# Altium project PBL4_Project.PrjPcb
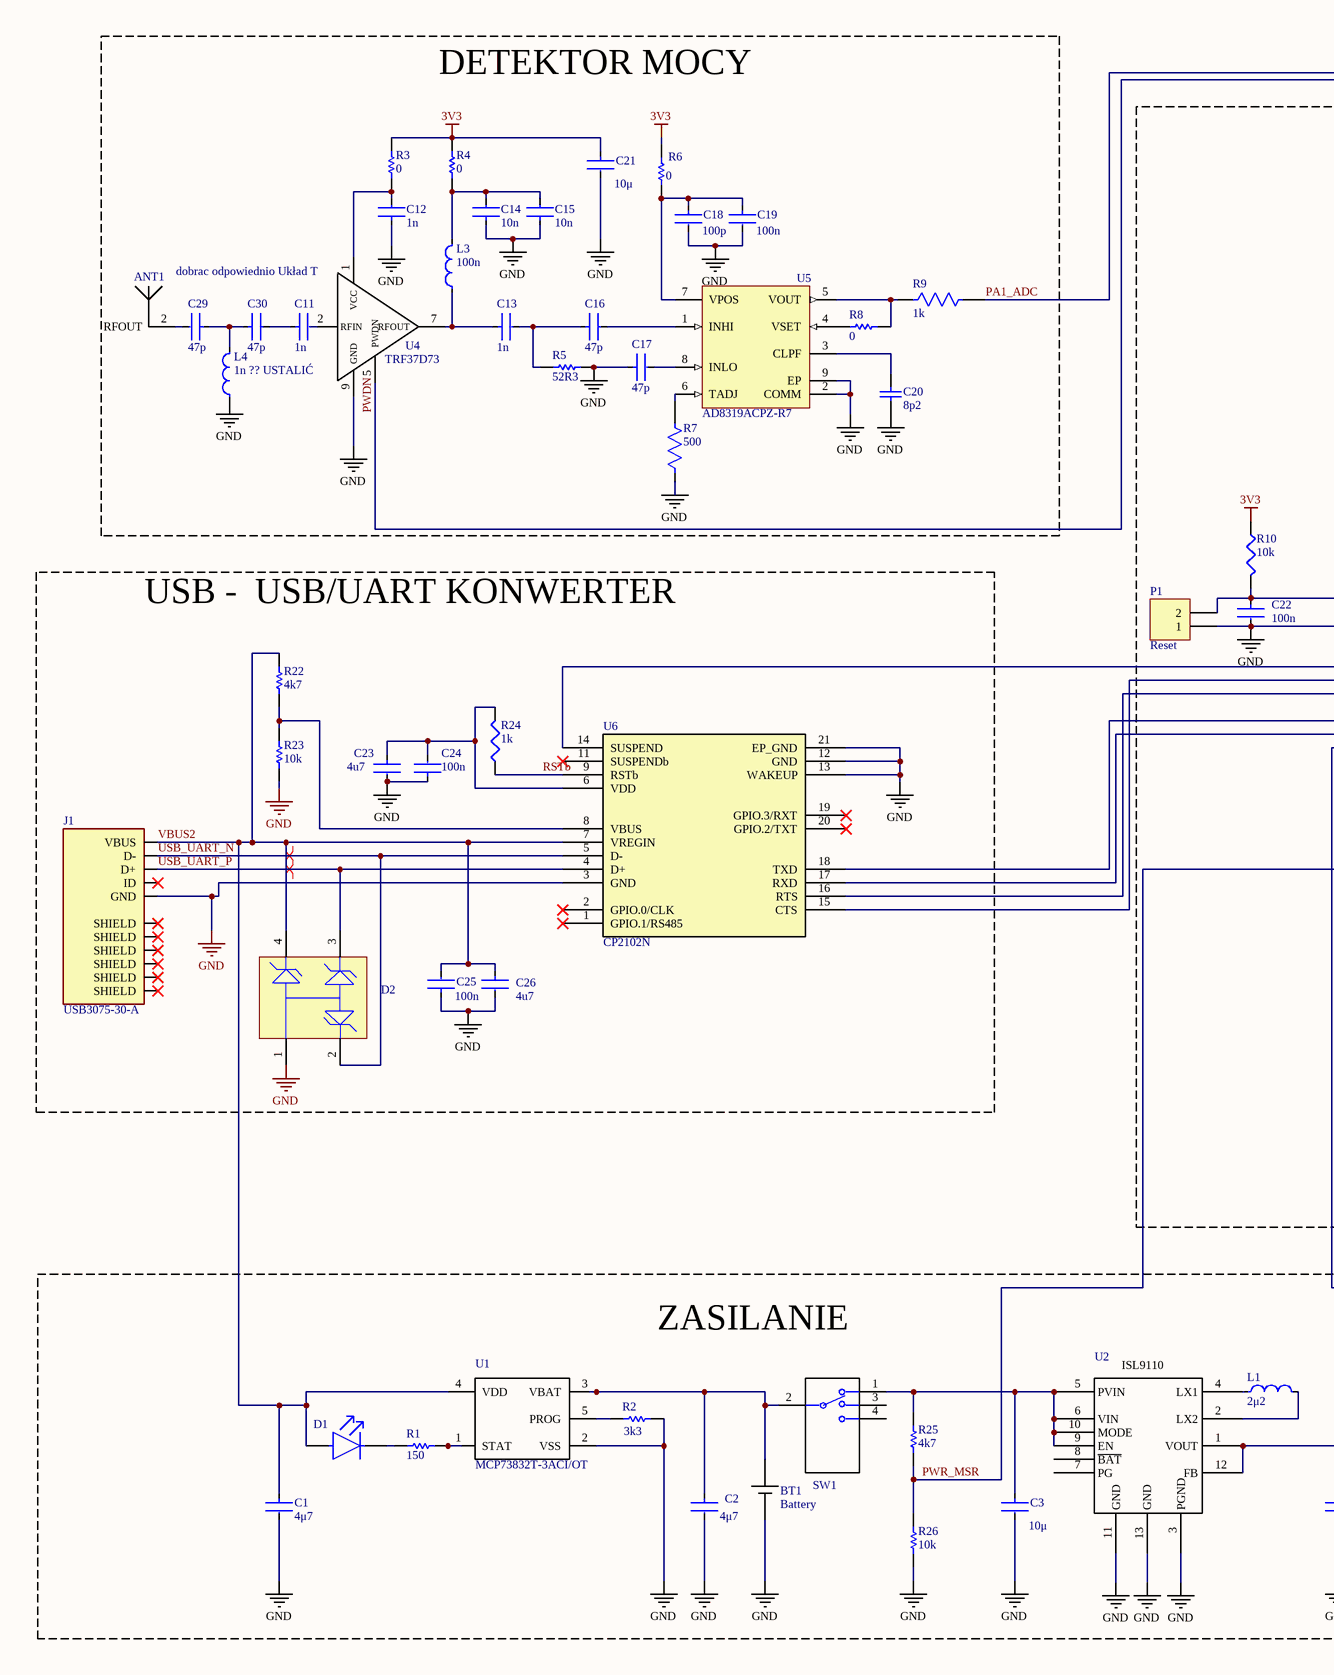
[diagram p0: PBL44_Sch.SchDoc, left]
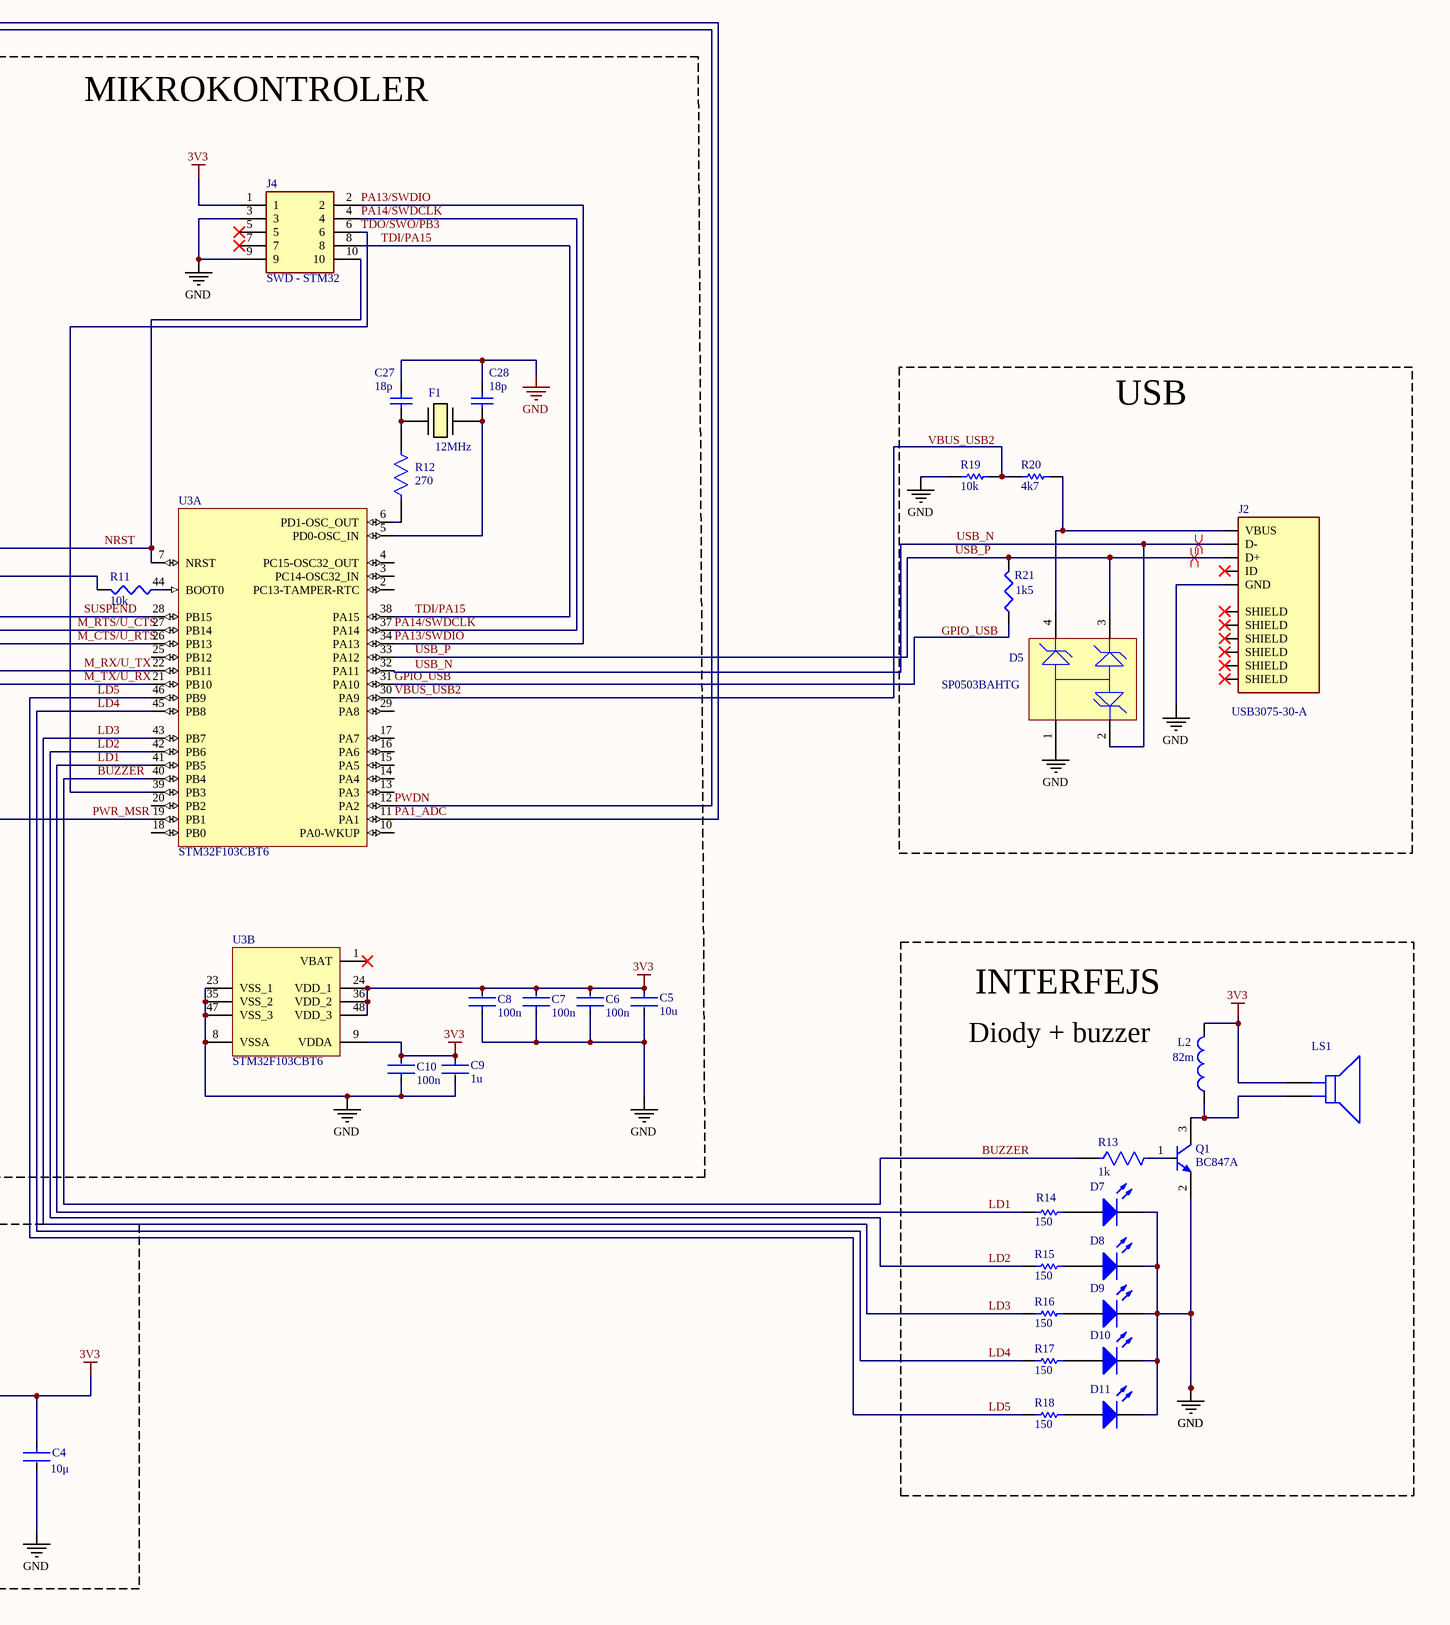
[diagram p1: PBL44_Sch.SchDoc, right]
1 sheet, 84 parts. Net scope: global (net labels, ports and power ports of the same name join across sheets).
Board file: PBL4_PCB.PcbDoc

## Sheet PBL44_Sch.SchDoc
size A2; SheetNumber: 1; SheetTotal: 1; SPICEModelCacheMSKFRAYQ: <root> / <DocumentId>MSKFRAYQ</DocumentId> / <CacheFrame Number="0"> / <Model Name="led1" Kind="MDL"> / <Text>*Typ RED GaAs LED: Vf=1.7V Vr=4V If=40mA trr=3uS / *LED Pinout: 1=A, 2=K / .MODEL LED1 D (IS=93.2P RS=42M N=3.73 BV=4 IBV=10U / + CJO=2.97P VJ=.75 M=.333 TT=4.32U)</Text> / </Model> / </CacheFrame> / </root>

### Parts
ANT1  2195852-1  [Antena]  (value not drawn)
BT1  Battery  [HDR1X2]
C1  Capacitance: 4μ7  [FP-C2012-125-0_2-IPC_B]
C2  Capacitance: 4μ7  [FP-C2012-125-0_2-IPC_B]
C3  value 10μ  [FP-C0805C-DG-MFG]
C4  value 10μ  [FP-C0805C-DG-MFG]
C5  value 10u  [FP-C0805C-DN-MFG]  (hidden comment: C0805C470J1GACTU)
C6  Capacitance: 100n  [FP-C0603C-CF-MFG]  (hidden comment: C0603C103K1RACTU)
C7  Capacitance: 100n  [FP-C0603C-CF-MFG]  (hidden comment: C0603C103K1RACTU)
C8  Capacitance: 100n  [FP-C0603C-CF-MFG]  (hidden comment: C0603C103K1RACTU)
C9  value 1u  [FP-C0805C-DN-MFG]  (hidden comment: C0805C470J1GACTU)
C10  Capacitance: 100n  [FP-C0603C-CF-MFG]  (hidden comment: C0603C103K1RACTU)
C11  Capacitance: 1n  [FP-0603-L_1_6_0_15-W_0_81-IPC_A]  (hidden comment: 06035C102KAT2A)
C12  Capacitance: 1n  [FP-0603-L_1_6_0_15-W_0_81-IPC_A]  (hidden comment: 06035C102KAT2A)
C13  Capacitance: 1n  [FP-0603-L_1_6_0_15-W_0_81-IPC_A]  (hidden comment: 06035C102KAT2A)
C14  Capacitance: 10n  [FP-C0603C-CF-MFG]  (hidden comment: C0603C103K1RACTU)
C15  Capacitance: 10n  [FP-C0603C-CF-MFG]  (hidden comment: C0603C103K1RACTU)
C16  value 47p  [FP-C0805C-DN-MFG]  (hidden comment: C0805C470J1GACTU)
C17  value 47p  [FP-C0805C-DN-MFG]  (hidden comment: C0805C470J1GACTU)
C18  Capacitance: 100p  [FP-C0603C-CF-MFG]  (hidden comment: C0603C104K5RACTU)
C19  Capacitance: 100n  [FP-C0603C-CF-MFG]  (hidden comment: C0603C104K5RACTU)
C20  Capacitance: 8p2  [CAPC1608X73X35ML10T15]  (hidden comment: 06035J8R2BBSTR)
C21  value 10μ  [FP-C0805C-DG-MFG]
C22  Capacitance: 100n  [FP-C2012-125-0_2-IPC_B]
C23  value 4u7  [FP-C0805C-DN-MFG]  (hidden comment: C0805C470J1GACTU)
C24  Capacitance: 100n  [FP-C0603C-CF-MFG]  (hidden comment: C0603C103K1RACTU)
C25  Capacitance: 100n  [FP-C0603C-CF-MFG]  (hidden comment: C0603C103K1RACTU)
C26  value 4u7  [FP-C0805C-DN-MFG]  (hidden comment: C0805C470J1GACTU)
C27  Capacitance: 18p  [CAPC1608X73X35ML10T15]  (hidden comment: 06035J8R2BBSTR)
C28  Capacitance: 18p  [CAPC1608X73X35ML10T15]  (hidden comment: 06035J8R2BBSTR)
C29  Capacitance: 47p  [FP-C0603C-CF-MFG]  (hidden comment: C0603C104K5RACTU)
C30  Capacitance: 47p  [FP-C0603C-CF-MFG]  (hidden comment: C0603C104K5RACTU)
D1  LTST-C190GKT  [FP-LTST-C190GKT-MFG]  (value not drawn)
D2  SP0503BAHTG  [LFUS-SOT143-4_V]  (value not drawn)
D5  SP0503BAHTG  [LFUS-SOT143-4_V]
D7  151051RS11000  [Type 5mm]  (value not drawn)
D8  151051RS11000  [Type 5mm]  (value not drawn)
D9  151051RS11000  [Type 5mm]  (value not drawn)
D10  151051RS11000  [Type 5mm]  (value not drawn)
D11  151051RS11000  [Type 5mm]  (value not drawn)
F1  12MHz  [HC/49US-(AT49)_1]
J1  USB3075-30-A  [GCT_USB3075-30-A]
J2  USB3075-30-A  [GCT_USB3075-30-A]
J4  SWD - STM32  [322110030000]
L1  Inductance: 2μ2  [FP-NR5040-H_4_1-MFG]  (hidden comment: NRS5040T2R2NMGJ)
L2  Inductance: 82m  [WE-TIS 1111]  (hidden comment: 7447471104)
L3  Inductance: 100n  [FP-LQW18AN_00-MFG]  (hidden comment: LQW18ANR10G00D)
L4  Inductance: 1n ?? USTALIĆ  [FP-LQW18AN_00-MFG]  (hidden comment: LQW18ANR10G00D)
LS1  7BB-20-6L0  [FP-7BB-20-6L0-MFG]  (value not drawn)
P1  Reset  [HDR1X2]
Q1  BC847A  [INF-SOT23_M]
R1  resistance: 150  [RESC1608X55X30ML15T15]  (hidden comment: ERJ-3EKF4700V)
R2  Resistance: 3k3  [RESC2013X60X35ML10T20]  (hidden comment: RC0805FR-073K3L)
R3  value 0  [RESC1609X50X30NL8T20]  (hidden comment: CRCW06030000Z0EA)
R4  value 0  [RESC1609X50X30NL8T20]  (hidden comment: CRCW06030000Z0EA)
R5  Resistance: 52R3  [RESC1608X55X30ML15T15]  (hidden comment: ERJ-3EKF52R3V)
R6  Resistance: 0  [RESC1609X50X30NL8T20]  (hidden comment: CRCW06030000Z0EA)
R7  Resistance: 500  [FP-MCT0603-MFG]  (hidden comment: MCT06030D5000BP100)
R8  Resistance: 0  [RESC1609X50X30NL8T20]  (hidden comment: CRCW06030000Z0EA)
R9  Resistance: 1k  [FP-CRCW0603-e3-MFG]  (hidden comment: CRCW06031K00FKEA)
R10  value 10k  [J1-0603]  (hidden comment: Res3)
R11  value 10k  [J1-0603]  (hidden comment: Res3)
R12  Resistance: 270  [FP-CRCW0603-e3-MFG]  (hidden comment: CRCW06031K00FKEA)
R13  Resistance: 1k  [FP-CRCW0603-e3-MFG]  (hidden comment: CRCW06031K00FKEA)
R14  resistance: 150  [RESC1608X55X30ML15T15]  (hidden comment: ERJ-3EKF4700V)
R15  resistance: 150  [RESC1608X55X30ML15T15]  (hidden comment: ERJ-3EKF4700V)
R16  resistance: 150  [RESC1608X55X30ML15T15]  (hidden comment: ERJ-3EKF4700V)
R17  resistance: 150  [RESC1608X55X30ML15T15]  (hidden comment: ERJ-3EKF4700V)
R18  resistance: 150  [RESC1608X55X30ML15T15]  (hidden comment: ERJ-3EKF4700V)
R19  Resistance: 10k  [RESC2013X60X35ML10T20]  (hidden comment: RC0805FR-073K3L)
R20  Resistance: 4k7  [RESC2013X60X35ML10T20]  (hidden comment: RC0805FR-073K3L)
R21  value 1k5  [J1-0603]  (hidden comment: Res3)
R22  Resistance: 4k7  [RESC2013X60X35ML10T20]  (hidden comment: RC0805FR-073K3L)
R23  Resistance: 10k  [RESC2013X60X35ML10T20]  (hidden comment: RC0805FR-073K3L)
R24  value 1k  [J1-0603]  (hidden comment: Res3)
R25  Resistance: 4k7  [RESC2013X60X35ML10T20]  (hidden comment: RC0805FR-073K3L)
R26  Resistance: 10k  [RESC2013X60X35ML10T20]  (hidden comment: RC0805FR-073K3L)
SW1  MHS133G04  [Alcoswitch_MHS133G04_0]  (value not drawn)
U1  MCP73832T-3ACI/OT  [SOT-23-OT5_M]
U2  ISL9110  [KM_L12.3x3C]  (value not drawn)
U3  STM32F103CBT6  [STM-LQFP48_L]  (parts A,B of 2)
U4  TRF37D73  [JD_WSON-8]
U5  AD8319ACPZ-R7  [ADI-CP-8-1_L]
U6  CP2102N  [ZW_QFN20]

### Blocks framed on the sheet
DETEKTOR MOCY: ANT1 C11-C21 C29 C30 L3 L4 R3-R9 U4 U5
MIKROKONTROLER: C5-C10 C22 C27 C28 F1 J4 P1 R10-R12 U3
USB: D5 J2 R19-R21
USB -  USB/UART KONWERTER: C23-C26 D2 J1 R22-R24 U6
INTERFEJS: D7-D11 L2 LS1 Q1 R13-R18
ZASILANIE: BT1 C1-C4 D1 L1 R1 R2 R25 R26 SW1 U1 U2

### Nets
3V3: C4.1 C5.1 C6.2 C7.2 C8.2 C9.1 C10.2 C21.1 J4.1 L2.2 LS1.17 R3.2 R4.2 R6.2 R10.1 U2.1(VOUT) U2.12(FB) U3.9(VDDA) U3.24(VDD_1) U3.36(VDD_2) U3.48(VDD_3)
GND: BT1.1 C1.2 C2.2 C3.2 C4.2 C5.2 C6.1 C7.1 C8.1 C9.2 C10.1 C12.1 C14.1 C15.1 C17.1 C18.2 C19.2 C20.1 C21.2 C22.2 C23.2 C24.1 C25.1 C26.2 C27.1 C28.2 D2.1 D5.1 D7.1(K) D8.1(K) D9.1(K) D10.1(K) D11.1(K) J1.5(GND) J2.5(GND) J4.3 J4.9 L4.1 P1.1 Q1.2(E) R2.2 R5.2 R7.1 R11.2 R19.2 R23.1 R26.2 U1.2(VSS) U2.3(PGND) U2.11(GND) U2.13(GND) U3.8(VSSA) U3.23(VSS_1) U3.35(VSS_2) U3.47(VSS_3) U4.9(GND) U5.2(COMM) U5.9(EP) U6.3(GND) U6.12(GND) U6.13(WAKEUP) U6.21(EP_GND)
BUZZER: R13.1 U3.40(PB4)
GPIO_USB: R21.1 U3.31(PA10)
LD1: R14.1 U3.41(PB5)
LD2: R15.1 U3.42(PB6)
LD3: R16.1 U3.43(PB7)
LD4: R17.1 U3.45(PB8)
LD5: R18.1 U3.46(PB9)
M_CTS/U_RTS: U3.26(PB13) U6.16(RTS)
M_RTS/U_CTS: U3.27(PB14) U6.15(CTS)
M_RX/U_TX: U3.22(PB11) U6.18(TXD)
M_TX/U_RX: U3.21(PB10) U6.17(RXD)
NRST: C22.1 J4.10 P1.2 R10.2 U3.7(NRST)
PA1_ADC: R9.2 U3.11(PA1)
PA13/SWDIO: J4.2 U3.34(PA13)
PA14/SWDCLK: J4.4 U3.37(PA14)
PWDN: U3.12(PA2) U4.5(PWDN)
PWR_MSR: R25.2 R26.1 U3.19(PB1)
RSTb: R24.2 U6.9(RSTb)
SUSPEND: U3.28(PB15) U6.14(SUSPEND)
TDI/PA15: J4.8 U3.38(PA15)
TDO/SWO/PB3: J4.6 U3.39(PB3)
USB_N: D5.2 J2.2(D-) U3.32(PA11)
USB_P: D5.3 J2.3(D+) R21.2 U3.33(PA12)
USB_UART_N: D2.2 J1.2(D-) U6.5(D-)
USB_UART_P: D2.3 J1.3(D+) U6.4(D+)
VBUS2: C1.1 C25.2 C26.1 D1.2(A) D2.4 J1.1(VBUS) R22.2 U1.4(VDD) U6.7(VREGIN)
VBUS_USB2: R19.1 R20.2 U3.30(PA9)
NetANT1_2: ANT1.2(RFOUT) C29.2
NetBT1_2: BT1.2 C2.1 SW1.2 U1.3(VBAT)
NetC3_1: C3.1 R25.1 SW1.1 U2.5(PVIN) U2.6(VIN) U2.9(EN) U2.10(MODE)
NetC11_1: C11.1 C30.2
NetC11_2: C11.2 U4.2(RFIN)
NetC12_2: C12.2 R3.1 U4.1(VCC)
NetC13_1: C13.1 L3.1 U4.7(RFOUT)
NetC13_2: C13.2 C16.1 R5.1
NetC14_2: C14.2 C15.2 L3.2 R4.1
NetC16_2: C16.2 U5.1(INHI)
NetC17_2: C17.2 U5.8(INLO)
NetC18_1: C18.1 C19.1 R6.1 U5.7(VPOS)
NetC20_2: C20.2 U5.3(CLPF)
NetC23_1: C23.1 C24.2 R24.1 U6.6(VDD)
NetC27_2: C27.2 F1.2 R12.2
NetC28_1: C28.1 F1.1 U3.5(PD0-OSC_IN)
NetC29_1: C29.1 C30.1 L4.2
NetD1_1: D1.1(C) R1.1
NetD5_4: D5.4 J2.1(VBUS) R20.1
NetD7_2: D7.2(A) R14.2
NetD8_2: D8.2(A) R15.2
NetD9_2: D9.2(A) R16.2
NetD10_2: D10.2(A) R17.2
NetD11_2: D11.2(A) R18.2
NetL1_1: L1.1 U2.4(LX1)
NetL1_2: L1.2 U2.2(LX2)
NetL2_1: L2.1 LS1.16 Q1.3(C)
NetQ1_1: Q1.1(B) R13.2
NetR1_2: R1.2 U1.1(STAT)
NetR2_1: R2.1 U1.5(PROG)
NetR7_2: R7.2 U5.6(TADJ)
NetR8_1: R8.1 U5.4(VSET)
NetR8_2: R8.2 R9.1 U5.5(VOUT)
NetR11_1: R11.1 U3.44(BOOT0)
NetR12_1: R12.1 U3.6(PD1-OSC_OUT)
NetR22_1: R22.1 R23.2 U6.8(VBUS)

Not connected (* = marked no-connect by the designer): ANT1 1(GND) 3(GND) 4(MNT); J1 4(ID)* S1(SHIELD)* S2(SHIELD)* S3(SHIELD)* S4(SHIELD)* S5(SHIELD)* S6(SHIELD)*; J2 4(ID)* S1(SHIELD)* S2(SHIELD)* S3(SHIELD)* S4(SHIELD)* S5(SHIELD)* S6(SHIELD)*; J4 5* 7*; SW1 3 4 5(MNT_1) 6(MNT_2); U2 7(PG) 8(~{BAT}); U3 1(VBAT)* 2(PC13-TAMPER-RTC) 3(PC14-OSC32_IN) 4(PC15-OSC32_OUT) 10(PA0-WKUP) 13(PA3) 14(PA4) 15(PA5) 16(PA6) 17(PA7) 18(PB0) 20(PB2) 25(PB12) 29(PA8); U6 1(GPIO.1/RS485)* 2(GPIO.0/CLK)* 11(SUSPENDb)* 19(GPIO.3/RXT)* 20(GPIO.2/TXT)*

### Layout directives
differential pair: USB_N, USB_P, USB_UART_N, USB_UART_P

### Notes on the sheet
- (near U4) dobrac odpowiednio Układ T
- (near L2) Diody + buzzer
- Labels drawn without touching a wire or pin: GPIO_USB, VBUS_USB2

### Library data of the parts
BT1 = KM_Battery_One_Cell
C1 C2 C22 = CMP-08246-000007-2: Multilayer Ceramic Capacitors 4.7μF ±10% 50V X5R SMD 0805; Case Code (Metric): 2012; Weight: 0.000194oz; Voltage Rating: 50V; Voltage: 50V; Construction: Flat; Series: C; Packaging: Tape and Reel; Height: 1.25mm; Depth: 1.25mm; Resistor Type: Ceramic; Width: 0.049inch; Length: 2mm; Thickness: 0.057inch; REACH SVHC: No SVHC; Max Operating Temperature: 85°C; Case/Package: 0805; Dielectric: X5R; Tolerance: 10%; Dielectric Material: Ceramic; Package Quantity: 1; Mount: Surface Mount; Radiation Hardening: No; Voltage Rating (DC): 50V; Case Code (Imperial): 0805; Termination: SMD/SMT; Min Operating Temperature: -55°C; Lead Free: Lead Free
C3 C4 C21 = CMP-2007-03243-2: CAP CER 10UF 10V X5R 0805; Manufacturer Part Number: C0805C106K8PACTU; Manufacturer: Kemet; 3DS Part Number: 220-00001; Tolerance: 10%; Temperature Coefficient: 15%; Material: Ceramic; Device Class L2: Capacitors; Device Class L1: Passive Components; ComponentLink2URL: https://content.kemet.com/datasheets/KEM_C1006_X5R_SMD.pdf; Height: 1.4mm; Lead Free: Yes; Digikey Description: CAP CER 10UF 10V X5R 0805; Octopart: https://octopart.com/c0805c106k8pactu-kemet-98697; Capacitance: 10uF; Temperature Range Low: -55°C; Temperature: -55°C to +85°C; Automotive: No; Mouser Description: CAP CER 10UF 10V X5R 0805; Ipc Land Pattern Name: CAPC200125X125; Temperature Range High: +85°C; Voltage: 10V; RoHS: TRUE; Device Class L3: Ceramic Capacitors; ComponentLink2Description: Datasheet; Voltage Rating: 10V; Package: C0805C-DG; Temperature Characteristic: X5R; Category: Cap
C5 C9 C16 C17 C23 C26 = CMP-1036-01631-3: CAP CER 47PF 100V 5% NP0 0805; Manufacturer: KEMET; Temperature Characteristic: C0G; Material: Ceramic; Temperature Coefficient: 30ppm/°C; Tolerance: 0.05; Device Class L3: Ceramic Capacitors; Package: C0805C-DN; Category: Cap; ComponentLink2URL: https://content.kemet.com/datasheets/KEM_C1003_C0G_SMD.pdf; Ipc Land Pattern Name: CAPC200125X78; Temperature Range Low: -55°C; Temperature: -55°C to +125°C; Temperature Range High: +125°C; Device Class L2: Capacitors; Height: 0.88mm; Octopart: https://octopart.com/c0805c470j1gactu-kemet-9138638; Digikey Description: CAP CER 47PF 100V 5% NP0 0805; Lead Free: Yes; Voltage Rating: 100 V; Device Class L1: Passive Components; Capacitance: 47 pF; Mouser Description: Capacitor: ceramic; MLCC; 47pF; 100V; C0G; ±5%; SMD; 0805; Manufacturer Part Number: C0805C470J1GACTU; RoHS: TRUE; ComponentLink2Description: Datasheet; Automotive: No
C6-C8 C10 C14 C15 C24 C25 = CMP-2006-03036-2: CAP CER 10000PF 100V X7R 0603; Manufacturer: KEMET; Temperature Coefficient: 30ppm/°C; Automotive Grade: Grade 1; Value: 10,000 pF; Tolerance: 0.1; Material: Ceramic; ComponentLink2URL: https://api.kemet.com/component-edge/download/datasheet/C0603C100J5GACAUTO.pdf; Height: 0.87mm; ComponentLink2Description: Datasheet; Category: Cap; Mouser Description: Multilayer Ceramic Capacitors MLCC - SMD/SMT 100volts 10000pF X7R 10%; Device Class L3: Ceramic Capacitors; Voltage Rating: 100 V; Temperature Range High: +125°C; Octopart: https://octopart.com/c0603c103k1ractu-kemet-134140; Package: C0603C-CF; Temperature Range Low: -55°C; Device Class L1: Passive Components; Temperature: -55°C to +125°C; RoHS: TRUE; Device Class L2: Capacitors; Lead Free: Yes; Temperature Characteristic: X7R; Manufacturer Part Number: C0603C103K1RACTU; Digikey Description: CAP CER 10000PF 100V X7R 0603; Automotive: Yes
C11-C13 = CMP-2006-04378-2: General Purpose Ceramic Capacitor, 0603, 1nF, 10%, X7R, 15%, 50V; Case Code (Metric): 1608; Min Operating Temperature: -55°C; Weight: 7.1E-05oz; Series: -; RoHS Compliant: Yes; Radiation Hardening: No; Height: 0.9mm; Mount: Surface Mount; REACH SVHC: No SVHC; Lead Free: Lead Free; Depth: 0.81mm; Voltage: 50V; Number of Pins: 2; Voltage Rating: 50V; Max Operating Temperature: 125°C; Termination: SMD/SMT; Construction: Flat; Case Code (Imperial): 0603; Dielectric: X7R; Width: 0.032inch; Tolerance: 10%; Case/Package: 0603; Contact Plating: Tin; Packaging: Tape and Reel; Voltage Rating (DC): 50V; Dielectric Material: Ceramic; Package Quantity: 4000; Thickness: 0.035inch; Length: 1.6mm
C18 C19 C29 C30 = CMP-2006-03061-2: CAP CER 0.1UF 50V X7R 0603; Manufacturer: KEMET; Tolerance: 0.1; Temperature Coefficient: 30ppm/°C; Material: Ceramic; Automotive Grade: Grade 1; Value: 0.10 μF; Temperature: -55°C to +125°C; RoHS: TRUE; Temperature Range High: +125°C; Lead Free: Yes; Octopart: https://octopart.com/c0603c104k5ractu-kemet-139244; Digikey Description: CAP CER 0.1UF 50V X7R 0603; Category: Cap; Package: C0603C-CF; ComponentLink2Description: Datasheet; Temperature Range Low: -55°C; Device Class L1: Passive Components; Voltage Rating: 50 V; Automotive: Yes; Device Class L3: Ceramic Capacitors; ComponentLink2URL: https://api.kemet.com/component-edge/download/datasheet/C0603C100J5GACAUTO.pdf; Device Class L2: Capacitors; Manufacturer Part Number: C0603C104K5RACTU; Temperature Characteristic: X7R; Height: 0.87mm
C20 C27 C28 = CMP-2006-04640-1: Manufacturer: AVX Interconnect / Elco; Part Number: 06035J8R2BBSTR
D1 = CMP-22017-000005-2: LED GREEN CLEAR CHIP SMD; Dominant Wavelength: 569nm; Reverse Voltage: 5V; Lens Color: Colorless; Viewing Angle: 130°; Voltage: 2V; Forward Current: 30mA; Power Dissipation: 100mW; Luminous Intensity: 6mcd; Number of LEDs: 1; Forward Voltage: 2.1V; Wavelength: 565nm; Test Current: 10mA; Min Operating Temperature: -55°C; Lens Style: Clear; Mount: Surface Mount; Width: 0.8mm; Packaging: Tape and Reel; Lens Transparency: Clear; Case Code (Metric): 1608; Depth: 0.8mm; Case Code (Imperial): 0603; Case/Package: 0603; Number of Pins: 2; Max Operating Temperature: 85°C; Lead Free: Lead Free; Number of Elements: 1; Length: 1.6mm; Height: 0.8mm; Package Quantity: 1; Power Rating: 100mW; Radiation Hardening: No; Illumination Color: Green; Color: Green
D2 D5 = CMP-2000-05191-1: TVS Diode Array, 30 pF, 30 KV, -40 to 85 degC, 4-Pin SOT143, RoHS, Tape and Reel; Manufacturer: Littelfuse; Direction Type: Uni-Directional; Product Height (mm): 1.05mm; Leakage Current (Max): 0.1uA; Clamping Voltage (Max): 8V; Reverse Stand-off Voltage: 5.5(Min)V; Configuration: Triple; Working Voltage: 5.5V; Product Length (mm): 3.04mm; Working Voltage (Max): 5.5V(Min); Capacitance Value: 30pF; Rad Hardened: No; Number of Elements: 3; Product Depth (mm): 1.4mm; Operating Temperature Max Deg. C: 85C; Suppressor Type: TVS; Operating Temperature Min Deg. C: -40C; Operating Temp Range: -40Cto85C; Mounting: SurfaceMount; Package / Case: SOT-143; Datasheet Version: Dec-13; Package Type: SOT-143; Packaging: TapeandReel; Pin Count: 3+Tab; Operating Temperature Classification: Industrial; Datasheet URL: https://datasheet.ciiva.com/15143/getdatasheetpartid-116020-15143550.pdf; Manufacturer URL: http://www.littelfuse.com/; Leakage Current: 0.1uA; Mounting Style: SurfaceMount; Clamping Voltage: 8V; Polarity: Uni-Directional
D7-D11 = CMP-1488-00008-1: THT LED round mono-color color lens, WL-TMRW, Red; Manufacturer: Wuerth Elektronik; PackageReference: Type 5mm; PartNumber: 151051RS11000; ComponentLink2URL: http://katalog.we-online.de/pbs/datasheet/7448042001.pdfhttp://katalog.we-online.de/pbs/datasheet/7448042001.pdfhttp://katalog.we-online.de/pbs/datasheet/7448042001.pdfhttp://katalog.we-online.de/pbs/datasheet/151051RS11000.pdf; ComponentLink1URL: http://www.we-online.com; ComponentLink1Description: Manufacturer URL; ComponentLink2Description: Datasheet; Emitting color: Red
F1 = ABLS-12.000MHZ-B4-T: Manufacturer_Name: ABRACON; Datasheet Link: https://componentsearchengine.com/Datasheets/2/ABLS-12.000MHZ-B4-T.pdf; Manufacturer_Part_Number: ABLS-12.000MHZ-B4-T; Mouser Part Number: 815-ABLS-12.0M-T; Mouser Price/Stock: https://www.mouser.co.uk/ProductDetail/ABRACON/ABLS-12000MHZ-B4-T?qs=yTU0IcKoRlGSQ8ooxPPVnQ%3D%3D; Arrow Part Number: ABLS-12.000MHZ-B4-T; Arrow Price/Stock: https://www.arrow.com/en/products/abls-12.000mhz-b4-t/abracon?region=nac
J1 J2 = USB3075-30-A: USB - micro B USB 2.0 Receptacle Connector 5 Position Surface Mount, Right Angle; Through Hole; MF: Global Connector Technology; SnapEDA_Link: https://www.snapeda.com/parts/USB3075-30-A/Global%20Connector%20Technology/view-part/229370/?ref=snap; Value: *; Digi-Key_Part_Number: 2073-USB3075-30-ACT-ND; MP: USB3075-30-A; Digi-Key_Purchase_URL: https://www.digikey.com/product-detail/en/gct/USB3075-30-A/2073-USB3075-30-ACT-ND/9859705?utm_source=snapeda&utm_medium=aggregator&utm_campaign=symbol; Package: None
J4 = 3221-10-0300-00: Connector; Manufacturer_Name: CNC Tech; Datasheet Link: http://cnctech.us/pdfs/3221-XX-0300-00.pdf; Height: 5.8mm; Manufacturer_Part_Number: 3221-10-0300-00; Arrow Part Number: 3221-10-0300-00; Arrow Price/Stock: https://www.arrow.com/en/products/3221-10-0300-00/cnc-tech-llc
L1 = CMP-14484-000953-1: SMD Power Inductors 2.2uH ±30% 3.7A 28.6mΩ; Core Material: Ferrite; DC Resistance (DCR): 28.6mR; Tolerance: 20%; Saturation Current: 5A; Shielding: Shielded; Self Resonant Frequency: 42MHz; Test Frequency: 100kHz; Min Operating Temperature: -25°C; Resistor Type: Wirewound; Current Rating: 3.7A; RoHS Compliant: Yes; Mount: Surface Mount; Max Operating Temperature: 120°C; Case/Package: Nonstandard; Packaging: Tape and Reel
L2 = CMP-1406-00011-1: Shielded Radial Leaded Wire Wound Inductor WE-TIS, L=100000 µH; Manufacturer: Wuerth Elektronik; ComponentLink2URL: http://www.we-online.de/katalog/media/pdf/7447471104.pdf; ComponentLink1Description: Manufacturer URL; ComponentLink2Description: Datasheet; PartNumber: 7447471104; ComponentLink1URL: http://www.we-online.com; PackageReference: WE-TIS 1111
L3 L4 = CMP-06042-014178-1: Wire Wound RF Inductor 100nH ±2% 220mA 0.68Ω 0603 (1608); Current: 140mA; Core Material: Non-Magnetic; Series Resistance: 680mR; Q Factor: 34; Test Frequency: 100MHz; Self Resonant Frequency: 1.8GHz; Shielding: Unshielded; Case/Package: 0603; Number of Pins: 2; Length: 1.6mm; Military Standard: Not; Min Operating Temperature: -55°C; REACH SVHC: No SVHC; Height - Seated (Max): 0.039inch; DC Resistance (DCR): 680mR; Lead Free: Lead Free; Termination: SMD/SMT; Height: 0.8mm; Case Code (Metric): 1608; DC Current: 220mA; Tolerance: 2%; Resistor Type: Wirewound; Mount: Surface Mount; Package Quantity: 4000; Depth: 1mm; Inductance Tolerance: 2%; Current Rating: 220mA; Max Operating Temperature: 125°C; Radiation Hardening: No; Case Code (Imperial): 0603; Max DC Current: 220mA; Packaging: Tape and Reel; Width: 0.8mm; Weight: 0.000106oz
LS1 = CMP-06202-000037-1: BUZZER ELEMENT STD 6.3KHZ; Outside Diameter: 20mm; Lead Length: 50mm; Insulation Resistance: 100MR; Impedance: 1kR; Capacitance: 10nF; Size: 0.79inch; Min Operating Temperature: -10°C; Lead Free: Contains Lead; Diameter: 20mm; Radiation Hardening: No; Max Operating Temperature: 40°C; Self Resonant Frequency: 6.3kHz; REACH SVHC: No SVHC; Mount: Wire; Termination: Wire Leads; Frequency: 6.3kHz; Max Frequency: 6.3kHz; Package Quantity: 600; Packaging: Bulk; Height: 0.42mm; Series: 7BB
P1 = Header 2: Header, 2-Pin; LatestRevisionDate: 17-Jul-2002; LatestRevisionNote: Re-released for DXP Platform.; Publisher: Altium Limited
Q1 = CMP-1177-00033-1: NPN Silicon AF Transistor, 45 V VCEO, 100 mA IC, SOT23, Reel, Green; Manufacturer: Infineon; fT (typ): 250Â MHz; IC (max): 100Â mA; Ptot (max): 330Â mW; ICM (max): 200Â mA; Green: TRUE; ICBO (max): 15Â nA; VEBO (max): 6Â V; VCEO (max): 45Â V; VCBO (max): 50Â V; Packing: Reel; ComponentLink2URL: http://www.infineon.com/dgdl/bc847series_bc848series_bc849series_bc850series.pdf?folderId=db3a304314dca389011541d30fa21656&fileId=db3a304314dca389011541d4630a1657; ComponentLink3Description: Package Specification; PackageVersion: Apr-08; Polarity: NPN; PackageReference: SOT23; ComponentLink3URL: http://www.infineon.com/dgdl/SOT23-Package_Overview.pdf?folderId=db3a30431936bc4b0119532290053c66&fileId=db3a30431936bc4b0119533468123c85; ComponentLink2Description: Datasheet; Mounting Technology: Surface Mount; ComponentLink1Description: Manufacturer URL; IBM (max): 200Â mA; PartNumber: BC847A; PackageDescription: 3-Pin Small Outline Transistor Package, 1.3 x 2.9 mm Body, 0.95 mm Pitch; ComponentLink1URL: http://www.infineon.com/
R1 R14-R18 = CMP-1012-00473-6: Chip Resistor, 470 Ohm, +/- 1%, 0.1 W, -55 to 155 degC, 0603 (1608 Metric), RoHS, Tape and Reel; Manufacturer: Panasonic; Voltage Rating: 75 V; Height: 0.45 mm; ComponentLink1Description: Manufacturer URL; Packaging: Tape and Reel; Max Operating Temperature: 155 degC; ComponentLink3Description: Package Specification; ComponentLink3URL: https://datasheet.ciiva.com/11808/0900766b80f806dd-11808207.pdf; ComponentLink2Description: Datasheet; RoHSCompliant: true; ComponentLink1URL: http://www.panasonic.com/; Min Operating Temperature: -55 degC; PackageReference: 0603; DatasheetVersion: 04/2015; REACH SVHC: Yes; Length: 1.6 mm; Mount: Surface Mount; Mounting Technology: Surface Mount; Pins: 2; ComponentLink2URL: http://industrial.panasonic.com/cdbs/www-data/pdf/RDA0000/AOA0000C86.pdf; PackageDescription: 2-Pin Surface Mount Device, Body 1.6 x 0.85 mm; Package Quantity: 1
R2 R19 R20 R22 R23 R25 R26 = CMP-1013-00567-2: Chip Resistor, 3.3 KOhm, +/- 1%, 0.125 W, -55 to 155 degC, 0805 (2012 Metric), RoHS, Tape and Reel; Manufacturer: Yageo; Voltage Rating: 150V; Max Power Dissipation: 125mW; Temperature Coefficient: 100ppm/degreesC; Package Quantity: 1; Max Operating Temperature: 155degC; Case Code (Metric): 2012; Package Reference: 0805; Composition: ThickFilm; RoHSCompliant: true; Case/Package: 0805; Case Code (Imperial): 0805; Tolerance: 1%; Depth: 1.25mm; Weight: 0.000194oz; Lead Free: LeadFree; Min Operating Temperature: -55degC; Termination: SMD/SMT; Datasheet Version: Rev. 5, 10/2016; REACH SVHC: NoSVHC; Power Rating: 125mW; Packaging: TapeandReel; Number of Terminations: 2; Width: 0.049inch; Package Description: 2-Pin Surface Mounted Device, Body 2 x 1.25 mm; Datasheet URL: http://www.yageo.com/NewPortal/yageodocoutput?fileName=/pdf/R-Chip/PYu-RC_Group_51_RoHS_L_5.pdf; Height: 0.5mm; Length: 2mm; Manufacturer URL: http://www.yageo.com/
R3 R4 R6 R8 = CMP-2000-03816-5: Chip Resistor, 0 Ohm, Jumper, 100 mW, -55 to 155 degC, 0603 (1608 Metric), RoHS, Tape and Reel; Manufacturer: Vishay Semiconductor; Voltage Rating: 75 V; Package Quantity: 5000; DatasheetVersion: 06/2012; Min Operating Temperature: -55 degC; ComponentLink1URL: http://www.vishay.com/; Mounting Technology: Surface Mount; ComponentLink1Description: Manufacturer URL; REACH SVHC: Unknown; PackageReference: 0603; Packaging: Tape and Reel; Max Operating Temperature: 155 degC; Mount: Surface Mount; ComponentLink2Description: Datasheet; PackageDescription: 2-Pin Surface Mount Device, Body 1.575 x 0.85 mm; Length: 1.55 mm; ComponentLink2URL: http://www.vishay.com/docs/20035/dcrcwe3.pdf; Pins: 2; RoHSCompliant: true
  R3: Height: 0.45mm
  R4 R6 R8: Height: 0.45 mm
R5 = CMP-2000-00553-1: Manufacturer: Panasonic; Part Number: ERJ-3EKF52R3V
R7 = CMP-02407-010017-1: RES SMD 100 OHM 1% 1/8W 0603; Tolerance: 0.1%; Height: 450um; Length: 1.55mm; Width: 850um; Case/Package: 0603; Lead Free: Lead Free
R9 R12 R13 = CMP-1666-00003-5: RES Thick Film, 1kΩ, 1%, 0.1W, 100ppm/°C, 0603; Max Power Dissipation: 100mW; Voltage Rating: 75V; Max Operating Temperature: 155°C; Number of Pins: 2; Case Code (Imperial): 0603; Width: 0.033inch; Power Rating: 100mW; Number of Terminations: 2; Package Quantity: 10; Weight: 7.1E-05oz; Tolerance: 1%; Temperature Coefficient: 100ppm/°C; Military Standard: Not; Mount: Surface Mount; Voltage Rating (DC): 75V; Depth: 0.85mm; Composition: Thick Film; Radiation Hardening: No; Termination: SMD/SMT; Length: 1.55mm; Case Code (Metric): 1608; Contact Plating: Tin; Min Operating Temperature: -55°C; Packaging: Tape and Reel; Height: 0.45mm; Lead Free: Lead Free; Case/Package: 0603; Features: Automotive AEC-Q200
R10 R11 R21 R24 = Res3: Resistor; Published: 8-Jun-2000; LatestRevisionDate: 29-May-2009; LatestRevisionNote: IPC-7351 Footprint Added.; PackageReference: J1-0603; Publisher: Altium Limited; PackageDescription: Chip Resistor
U1 = CMP-0133-00135-1: Miniature Single-Cell, Fully Integrated Li-Ion, Li-Polymer Charge Management Controller, 4.35V, 5-Pin SOT-23, Industrial Temperature, Tape and Reel; DatasheetVersion: revE, Sep-2008; PackageReference: SOT-23-OT5; PackageVersion: revBB, Aug-2009; Code_IPC: SOT23-5; PackageDescription: 5-Lead Plastic Small Outline Transistor (OT) [SOT-23]
U2 = KM_ISL9110: L12.3x3C
U3 = CMP-0237-00250-3: ARM Cortex-M3 32-bit MCU, 128 KB Flash, 20 KB Internal RAM, 37 I/Os, 48-pin LQFP, -40 to 85 degC, Tray; Supply Voltage(Vcc) min (V): 2; Operating Frequency(F) (Processor speed) (MHz): 72; A/D Converter: 2x12-bit (10 Channel); FLASH Size (Prog) (kB): 128; Internal RAM Size (kB): 20; I/Os (High Current): 37; ComponentLink2Description: Datasheet; PackageReference: LQFP48; PartNumber: STM32F103CBT6; ComponentLink1Description: Manufacturer URL; DatasheetVersion: Rev. 16; PackageVersion: Rev. 6, 06/2013; Packing: Tray; ComponentLink1URL: http://www.st.com/web/en/home.html; Mounting Technology: Surface Mount; ComponentLink3URL: http://www.st.com/st-web-ui/static/active/en/resource/technical/document/datasheet/DM00058181.pdf; PackageDescription: 48-Pin Low Profile Quad Flat Package, 7 x 7 mm Body, 0.5 mm Pitch; Core: ARM Cortex-M3; ComponentLink3Description: Package Specification; ComponentLink2URL: http://www.st.com/st-web-ui/static/active/en/resource/technical/document/datasheet/CD00161566.pdf
U4 = JD_TRF37D73_WSON-8
U5 = CMP-0284-00069-1: 1 MHz to 10 GHz, 45 dB Log Detector/Controller, 6ns Response Time, CP-8-1, Pb-Free, 3000 Reel; Temp Stability (dB): 500mdB; Voltage Supply (V): 3 to 5.5; Dynamic Range (dB): 45dB; Product Description: Available in Die; Supply Current: 22mA; RF Frequency (MHz): 1 to 10000; PackageReference: CP-8-1; ComponentLink3Description: Package Specification; ComponentLink3URL: http://www.analog.com/static/imported-files/packages/PKG_PDF/LFCSP(CP)/CP-8/CP_8_1.pdf; ComponentLink1Description: Manufacturer URL; Response Time (ns typ): 6ns; ComponentLink2URL: http://www.analog.com/static/imported-files/data_sheets/AD8319.pdf; PackageVersion: 031207-A; ComponentLink2Description: Datasheet; DatasheetVersion: Rev. B; PackageDescription: 8-Lead Lead Frame Chip Scale Package [LFCSP_VD]; ComponentLink1URL: www.analog.com
U6 = ZW_CP2102N-A02-GQFN20R